# Altium project Second_project.PrjPcb
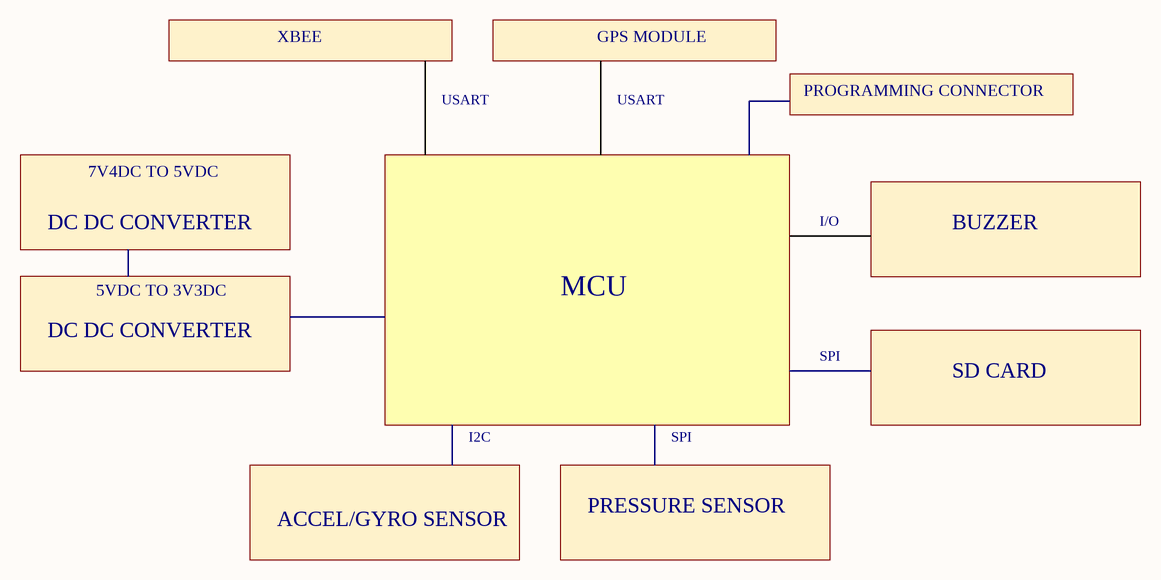
[diagram p0: BlockdiagramSTM32.SchDoc]
3 sheets, 43 parts. Net scope: flat (ports and power ports of the same name join across sheets).
Board file: PCB_STM32.PcbDoc
Sheets:
  BlockdiagramSTM32.SchDoc
  STM32.SchDoc
  MCUs_STM32.SchDoc

## Sheet BlockdiagramSTM32.SchDoc
size A3; SheetNumber: 1; SheetTotal: 3

### Notes on the sheet
- XBEE
- GPS MODULE
- USART
- PROGRAMMING CONNECTOR
- 7V4DC TO 5VDC
- I/O
- DC DC CONVERTER
- 5VDC TO 3V3DC
- BUZZER
- MCU
- SPI
- SD CARD
- I2C
- ACCEL/GYRO SENSOR
- PRESSURE SENSOR
- Document Name
- Prepared By
- Company Name
- Checked By
- A. Can KARACAN
- Release Date
- Department
- R&D- Hardware
- Size
- Change Date
- A3
- Approved By
- Sheet
- /

## Sheet STM32.SchDoc
size A3; SheetNumber: 2; SheetTotal: 3
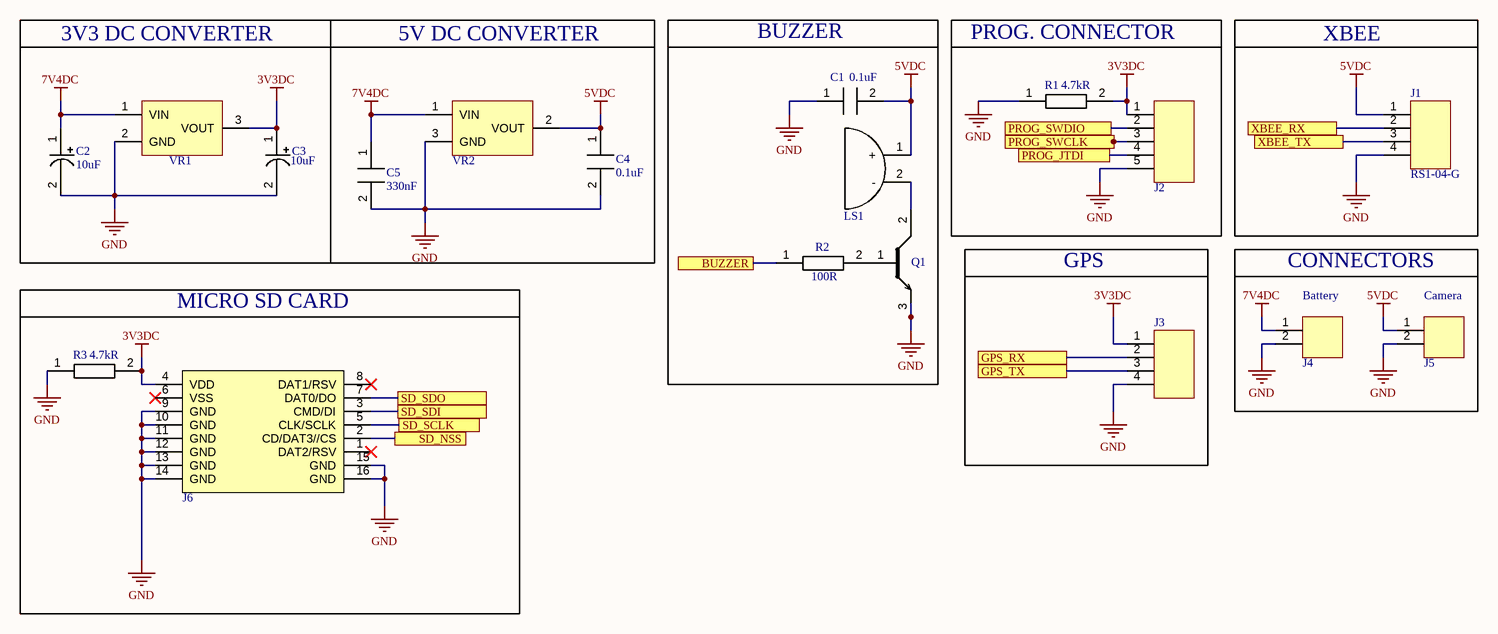
[diagram p1: STM32.SchDoc]

### Parts
C1  value 0.1uF  [CAP_1206]  (hidden comment: C1206C104K3RAC7800)
C2  value 10uF  [CAP_1206_TANT]  (hidden comment: T494A106M020AT)
C3  value 10uF  [CAP_1206_TANT]  (hidden comment: T494A106M020AT)
C4  value 0.1uF  [CAP_1206]  (hidden comment: C1206C104K3RAC7800)
C5  value 330nF  [CAP_1206]  (hidden comment: C1206C104K3RAC7800)
J1  RS1-04-G  [PINHEADER_1X4_TH]
J2  SMH-105-02-L-S  [PINHEADER1X5_RA]  (value not drawn)
J3  RS1-04-G  [PINHEADER_1X4_TH]  (value not drawn)
J4  0393570002  [2P_FEMALE_3.5MM_CONN]  (value not drawn)
J5  0393570002  [2P_FEMALE_3.5MM_CONN]  (value not drawn)
J6  2201778-1  [MICRO_SD]  (value not drawn)
LS1  CMI-9605-0580T  [CMI-9605]  (value not drawn)
Q1  MMBT3904-7-F  [SOT_23_3]  (value not drawn)
R1  value 4.7kR  [RE_1206]  (hidden comment: RC1206FR-074K7L)
R2  value 100R  [RE_0603]  (hidden comment: RC0603JR-07100RL)
R3  value 4.7kR  [RE_1206]  (hidden comment: RC1206FR-074K7L)
VR1  LD1117V33  [DPAK_TO-252-3]  (value not drawn)
VR2  L7805CDT-TR  [DPAK_TO-252-3]  (value not drawn)

### Blocks framed on the sheet
3V3 DC CONVERTER: C2 C3 VR1
BUZZER: C1 LS1 Q1 R2
PROG. CONNECTOR: J2 R1
XBEE: J1
CONNECTORS: J4 J5
GPS: J3

### Ports
BUZZER (see MCUs_STM32[4B]), GPS_RX (see MCUs_STM32[6B]), GPS_TX (see MCUs_STM32[6B]), PROG_JTDI (see MCUs_STM32[6B]), PROG_SWCLK (see MCUs_STM32[6B]), PROG_SWDIO (see MCUs_STM32[6B]), SD_NSS (see MCUs_STM32[4B]), SD_SCLK (see MCUs_STM32[4B]), SD_SDI (see MCUs_STM32[4C]), SD_SDO (see MCUs_STM32[4C]), XBEE_RX (see MCUs_STM32[6B]), XBEE_TX (see MCUs_STM32[6B])

### Nets
3V3DC: C3.1 J2.1 J3.1 J6.4(VDD) R1.2 R3.2 VR1.3(VOUT)
5VDC: C1.2 C4.1 J1.1 J5.1 LS1.1(+) VR2.2(VOUT)
7V4DC: C2.1 C5.1 J4.1 VR1.1(VIN) VR2.1(VIN)
GND: C1.1 C2.2 C3.2 C4.2 C5.2 J1.4 J2.5 J3.4 J4.2 J5.2 J6.9(GND) J6.10(GND) J6.11(GND) J6.12(GND) J6.13(GND) J6.14(GND) J6.15(GND) J6.16(GND) Q1.3 R1.1 R3.1 VR1.2(GND) VR2.3(GND)
NetJ1_2: J1.2 ; port XBEE_RX
NetJ1_3: J1.3 ; port XBEE_TX
NetJ2_2: J2.2 ; port PROG_SWDIO
NetJ2_3: J2.3 ; port PROG_SWCLK
NetJ2_4: J2.4 ; port PROG_JTDI
NetJ3_2: J3.2 ; port GPS_RX
NetJ3_3: J3.3 ; port GPS_TX
NetJ6_2: J6.2(CD/DAT3//CS) ; port SD_NSS
NetJ6_3: J6.3(CMD/DI) ; port SD_SDI
NetJ6_5: J6.5(CLK/SCLK) ; port SD_SCLK
NetJ6_7: J6.7(DAT0/DO) ; port SD_SDO
NetLS1_2: LS1.2(-) Q1.2
NetQ1_1: Q1.1 R2.2
NetR2_1: R2.1 ; port BUZZER

Not connected (* = marked no-connect by the designer): J6 1(DAT2/RSV)* 6(VSS)* 8(DAT1/RSV)*

### Notes on the sheet
- 5V DC CONVERTER
- MICRO SD CARD
- (near J4) Battery
- (near J5) Camera
- Document Name
- Prepared By
- Company Name
- Checked By
- A. Can KARACAN
- Release Date
- Department
- R&D- Hardware
- Size
- Change Date
- A3
- Approved By
- Sheet
- /

### Library data of the parts
C1 C4 = CAP CER 0.1uF 1206: Multilayer Ceramic Capacitor, 0.1 uF, 25 V, ± 10%, X7R, 1206 [3216 Metric]; Manufacturer: KEMET; Manufacturer Part Number: C1206C104K3RACTU; Material: 4241ConductorMaterial; Voltage Rating: 25V; Dissipation Factor: 3.5%; Designed By: Ahmet Can; Supplier: Digi-Key; Supplier Part Number: 399-C1206C104K3RAC7800CT-ND; RoHS: Yes; Category: Ceramic Capacitors; Stock: 306395; Pricing: 1=0,1, 10=0,072, 50=0,0408, 100=0,0338, 500=0,02372, 1000=0,01963 (USD); Mounting Technology: Surface Mount; Case/Package: 1206; Case Code (Metric): 3216; Case Code (Imperial): 1206; Dielectric Material: Ceramic; Min Operating Temperature: -55°C; Max Operating Temperature: 125°C; Tolerance: 10%; Dielectric: X7R; Packaging: Cut Tape; Package Quantity: 4000; Voltage Rating (DC): 25V; Termination: SMD/SMT; Series: C; Construction: Flat; Length: 3.2mm; Width: 0.063inch; Height: 0.78mm; Depth: 1.6mm; Thickness: 0.035inch; Reach SVHC Compliant: No; RoHS Compliant: Yes; ComponentLink1URL: https://datasheet.ciiva.com/5416/kem-c1002-x7r-smd-5416282.pdf?src-supplier=Mouser; ComponentLink1Description: https://datasheet.ciiva.com/5416/kem-c1002-x7r-smd-5416282.pdf?src-supplier=Mouser
C2 C3 = CAP TAN 10uF 2306: Cap Tant Solid 10uF 20V A CASE 20% (3.2 X 1.6 X 1.6mm) SMD 3216-18 3 Ohm 125 C T/R; Manufacturer: KEMET; Supplier: Digi-Key; Supplier Part Number: 399-5157-1-ND; Manufacturer Part Number: T494A106M020AT; RoHS: Yes; Category: Tantalum Capacitors; Stock: 64164; Pricing: 1=0,78, 10=0,596, 50=0,495, 100=0,4262, 500=0,32996, 1000=0,28414 (USD); ComponentLink1URL: https://datasheet.ciiva.com/22691/1778347-22691442.pdf?src-supplier=Element14; ComponentLink1Description: https://datasheet.ciiva.com/22691/1778347-22691442.pdf?src-supplier=Element14; ComponentLink2URL: https://datasheet.ciiva.com/258/kem-t2008-t494-258774.pdf?src-supplier=Digi-Key; ComponentLink2Description: https://datasheet.ciiva.com/258/kem-t2008-t494-258774.pdf?src-supplier=Digi-Key; ComponentLink3URL: https://datasheet.ciiva.com/258/kem-t2008-t494-258775.pdf?src-supplier=Digi-Key; ComponentLink3Description: https://datasheet.ciiva.com/258/kem-t2008-t494-258775.pdf?src-supplier=Digi-Key; ComponentLink4URL: https://datasheet.ciiva.com/258/kem-t2008-t494-258776.pdf?src-supplier=Digi-Key; ComponentLink4Description: https://datasheet.ciiva.com/258/kem-t2008-t494-258776.pdf?src-supplier=Digi-Key
C5 = CAP CER 330nF 1206: Cap Ceramic 0.33uF 16V X7R 10% SMD 1206 125°C Plastic T/R; Manufacturer: KEMET; Manufacturer Part Number: C1206C334K4RAC7800; Designed By: Ahmet Can; Supplier: Digi-Key; Supplier Part Number: 399-C1206C334K4RAC7800CT-ND; RoHS: Yes; Category: Ceramic Capacitors; Stock: 6810; Pricing: 1=0,21, 10=0,144, 50=0,096, 100=0,0816, 500=0,0576, 1000=0,0504 (USD); Mounting Technology: Surface Mount; Case/Package: 1206; Dielectric Material: Ceramic; Min Operating Temperature: -55°C; Max Operating Temperature: 125°C; Tolerance: 10%; Dielectric: X7R; Packaging: Tape and Reel; Voltage Rating (DC): 16V; Construction: Flat; Length: 3.2mm; Height: 0.78mm; Depth: 1.6mm; Radiation Hardening: No; RoHS Compliant: Yes; ComponentLink1URL: http://www.kemet.com/kemet/web/homepage/kechome.nsf/weben/C4DA2DA1D1C9D3C3CA2570A50016092D/$file/KEM_C1002_X7R_SMD.pdf; ComponentLink1Description: http://www.kemet.com/kemet/web/homepage/kechome.nsf/weben/C4DA2DA1D1C9D3C3CA2570A50016092D/$file/KEM_C1002_X7R_SMD.pdf
J1 J3 = J_RS1-04-G: 4 Position Receptacle Connector 0.100" (2.54mm) Through Hole Gold; Manufacturer: Adam Equipment; Supplier: Digi-Key; Supplier Part Number: 2057-RS1-04-G-ND; Manufacturer Part Number: RS1-04-G; RoHS: No; Category: Headers and Wire Housings; Stock: 4500; Pricing: 1=0,31, 10=0,267, 80=0,20788, 800=0,15695, 1600=0,14084, 5600=0,12726, 10400=0,11878 (USD); ComponentLink1URL: https://datasheet.ciiva.com/19462/2169758-19462353.pdf?src-supplier=Jameco; ComponentLink1Description: https://datasheet.ciiva.com/19462/2169758-19462353.pdf?src-supplier=Jameco
J2 = J_SMH-105-02-L-S: 5 Position Receptacle Connector 0.100" (2.54mm) Surface Mount, Right Angle Gold; Manufacturer: Samtec; Number of Contacts: 5; Designed By: Ahmet Can; Supplier: Digi-Key; Supplier Part Number: SAM11813-ND; Manufacturer Part Number: SMH-105-02-L-S; RoHS: Yes; Category: Connectors; Stock: 47; Pricing: 1=2,18, 10=1,899, 100=1,6968, 500=1,414, 1000=1,212, 5000=1,07464 (USD); Contact Plating: Gold; Contact Material: Bronze; Contact Finish - Mating: GOLD; Insulation Color: Black; Insulation Material: Polymer; Contact Shape: Square; Min Operating Temperature: -55°C; Max Operating Temperature: 125°C; Packaging: Rail/Tube; Number of Rows: 1; Termination: Solder; Gender: Receptacle; Orientation: Horizontal; Connector Type: Receptacle; Fastening Type: Pull; Series: SMH; Contact Type: Forked; Number of Positions: 5; Pitch: 2.54mm; Radiation Hardening: No; RoHS Compliant: Yes; Reach SVHC Compliant: No; Flammability Rating: UL94 V-0; ComponentLink1URL: http://www.farnell.com/datasheets/1927708.pdf?_ga=2.237598468.569325269.1503285096-1413671594.1503025027&src-supplier=Farnell; ComponentLink1Description: http://www.farnell.com/datasheets/1927708.pdf?_ga=2.237598468.569325269.1503285096-1413671594.1503025027&src-supplier=Farnell; ComponentLink2URL: http://www.samtec.com/documents/webfiles/pdf/SMH.PDF?src-supplier=Newark; ComponentLink2Description: http://www.samtec.com/documents/webfiles/pdf/SMH.PDF?src-supplier=Newark; ComponentLink3URL: http://www.samtec.com/documents/webfiles/pdf/SMH.PDF?src-supplier=Avnet; ComponentLink3Description: http://www.samtec.com/documents/webfiles/pdf/SMH.PDF?src-supplier=Avnet; ComponentLink4URL: http://suddendocs.samtec.com/catalog_english/smh.pdf?src-supplier=Digi-Key; ComponentLink4Description: http://suddendocs.samtec.com/catalog_english/smh.pdf?src-supplier=Digi-Key
J4 J5 = J_2P_FML_3.5MM: 3.50mm Pitch Beau Eurostyle Fixed Mount PCB Terminal Block, 2 Circuits; Manufacturer: Molex; Supplier: Digi-Key; Supplier Part Number: WM7877-ND; Manufacturer Part Number: 0393570002; RoHS: Yes; Stock: 107955; Pricing: 1=1,04, 10=0,729, 25=0,6804, 50=0,6174, 100=0,6147, 250=0,51908, 500=0,49176, 1000=0,43713, 5000=0,35517 (USD); ComponentLink1URL: https://datasheet.ciiva.com/6751/393590004-sd-6751377.pdf?src-supplier=Digi-Key; ComponentLink1Description: https://datasheet.ciiva.com/6751/393590004-sd-6751377.pdf?src-supplier=Digi-Key
J6 = J_2201778-1: Conn Memory Card RCP 8 POS 1.1mm Solder RA SMD 0.5A/Contact T/R; Manufacturer: TE Connectivity; Underplate Material: Nickel; Number of Positions: 8; Shielding: Unshielded; Contact Current Rating: 500mA; Circuit Application: Signal; Pitch: 0.04inch; Designed By: Ahmet Can; Supplier: Digi-Key; Supplier Part Number: A118117CT-ND; Manufacturer Part Number: 2201778-1; RoHS: Yes; Category: Memory Connectors; Stock: 6669; Pricing: 1=2,81, 10=2,503, 25=2,49, 50=2,4646, 100=2,2614, 250=2,24864, 500=2,04538 (USD); Mounting Technology: Surface Mount; Contact Material: Copper Alloy; Contact Plating: Gold; Housing Color: Black; Color: Black; Housing Material: Polymer; Shell Material: Copper Alloy; Min Operating Temperature: -30°C; Max Operating Temperature: 85°C; Packaging: Tape and Reel; Number of Rows: 1; Series: -; Termination: SMD/SMT; Flammability Rating: UL94 V-0; RoHS Compliant: Yes; Lead Free: Lead Free; ELV: Compliant; Reach SVHC Compliant: Unknown; ComponentLink1URL: https://datasheet.ciiva.com/23834/1737844-23834387.pdf?src-supplier=Newark; ComponentLink1Description: https://datasheet.ciiva.com/23834/1737844-23834387.pdf?src-supplier=Newark; ComponentLink2URL: https://datasheet.ciiva.com/22783/600547-22783409.pdf?src-supplier=Farnell; ComponentLink2Description: https://datasheet.ciiva.com/22783/600547-22783409.pdf?src-supplier=Farnell; ComponentLink3URL: https://datasheet.ciiva.com/22796/1651579-22796241.pdf?src-supplier=Farnell; ComponentLink3Description: https://datasheet.ciiva.com/22796/1651579-22796241.pdf?src-supplier=Farnell; ComponentLink4URL: https://datasheet.ciiva.com/29722/eng-cd-2201778-a-29722873.pdf?src-supplier=Digi-Key; ComponentLink4Description: https://datasheet.ciiva.com/29722/eng-cd-2201778-a-29722873.pdf?src-supplier=Digi-Key; ComponentLink5URL: https://datasheet.ciiva.com/22710/600547-22710877.pdf?src-supplier=Element14; ComponentLink5Description: https://datasheet.ciiva.com/22710/600547-22710877.pdf?src-supplier=Element14; ComponentLink6URL: https://datasheet.ciiva.com/22726/600547-22726299.pdf?src-supplier=Element14; ComponentLink6Description: https://datasheet.ciiva.com/22726/600547-22726299.pdf?src-supplier=Element14; ComponentLink7URL: https://datasheet.ciiva.com/29722/eng-cd-2201778-a-29722874.pdf?src-supplier=Digi-Key; ComponentLink7Description: https://datasheet.ciiva.com/29722/eng-cd-2201778-a-29722874.pdf?src-supplier=Digi-Key
LS1 = LS_CMI-9605-0580T: 9.6 mm, 5 Vdc, 80 dB, Through Hole, Driving Circuit, Magnetic Audio Indicator Buzzer; Manufacturer: CUI; Designed By: Ahmet Can; Min Supply Voltage: 3V; Max Supply Voltage: 7V; SPL: 80dB @ 5V, 10cm; Nominal Supply Voltage: 5V; Frequency: 2.7kHz; Supply Current: 30mA; Supplier: Digi-Key; Supplier Part Number: 102-CMI-9605-0580T-ND; Manufacturer Part Number: CMI-9605-0580T; RoHS: No; Max Operating Temperature: 70°C; Min Operating Temperature: -30°C; Mounting Technology: Through Hole; Packaging: Box; Case/Package: CMI-9605; Voltage Rating: 5V
Q1 = Q_MMBT3904-7-F: Transistor General Purpose BJT NPN 40 Volt 0.2A Automotive 3-Pin SOT-23-3; Manufacturer: Diodes Zetex; Max Power Dissipation: 300mW; Collector Emitter Voltage (VCEO): 40V; Max Collector Current: 200mA; Collector Base Voltage (VCBO): 60V; Power Dissipation: 350mW; Frequency: 300MHz; hFE Min: 100; Number of Elements: 1; Emitter Base Voltage (VEBO): 6V; Collector Emitter Saturation Voltage: 300mV; Designed By: Ahmet Can; Supplier: Digi-Key; Supplier Part Number: MMBT3904-FDICT-ND; Manufacturer Part Number: MMBT3904-7-F; RoHS: Yes; Category: BJTs; Stock: 5948624; Pricing: 1=0,12, 10=0,111, 100=0,0607, 500=0,03732, 1000=0,02545 (USD); Mounting Technology: Surface Mount; Case/Package: SOT-23; Pins: 3; Weight: 0.000282oz; Min Operating Temperature: -55°C; Max Operating Temperature: 150°C; Polarity: NPN; Packaging: Tape and Reel; Voltage Rating (DC): 40V; Package Quantity: 3000; Transition Frequency: 300MHz; Collector Emitter Breakdown Voltage: 40V; Max Breakdown Voltage: 40V; Continuous Collector Current: 200mA; Clock Frequency: 300MHz; Gain Bandwidth Product: 300MHz; Series: Automotive, AEC-Q101; Collector-emitter Voltage-Max: 300mV; Length: 3.05mm; Width: 1.4mm; Height: 1mm; Radiation Hardening: No; Reach SVHC Compliant: No; Lead Free: Lead Free; RoHS Compliant: Yes; ComponentLink1URL: https://datasheet.ciiva.com/11201/ds30036-11201778.pdf?src-supplier=Avnet; ComponentLink1Description: https://datasheet.ciiva.com/11201/ds30036-11201778.pdf?src-supplier=Avnet; ComponentLink2URL: https://datasheet.ciiva.com/15138/getdatasheetpartid-53265-15138780.pdf?src-supplier=Verical; ComponentLink2Description: https://datasheet.ciiva.com/15138/getdatasheetpartid-53265-15138780.pdf?src-supplier=Verical; ComponentLink3URL: https://datasheet.ciiva.com/22711/1915516-22711750.pdf?src-supplier=Element14; ComponentLink3Description: https://datasheet.ciiva.com/22711/1915516-22711750.pdf?src-supplier=Element14; ComponentLink4URL: https://datasheet.ciiva.com/11198/ds30036-11198999.pdf?src-supplier=Avnet; ComponentLink4Description: https://datasheet.ciiva.com/11198/ds30036-11198999.pdf?src-supplier=Avnet; ComponentLink5URL: https://datasheet.ciiva.com/6361/ds30036-6361256.pdf?src-supplier=Digi-Key; ComponentLink5Description: https://datasheet.ciiva.com/6361/ds30036-6361256.pdf?src-supplier=Digi-Key; ComponentLink6URL: https://datasheet.ciiva.com/6361/ds30036-6361254.pdf?src-supplier=Digi-Key; ComponentLink6Description: https://datasheet.ciiva.com/6361/ds30036-6361254.pdf?src-supplier=Digi-Key
R1 R3 = RES 4K7 1206: SMD Chip Resistor, 4.7 kOhm, ± 1%, 250 mW, 1206 [3216 Metric], Thick Film, General Purpose; Manufacturer: Yageo; Voltage Rating (DC): 200V; Temperature Coefficient: 100ppm/°C; Power Rating: 250mW; Designed By: Ahmet Can; Supplier: Digi-Key; Supplier Part Number: 311-4.70KFRCT-ND; Manufacturer Part Number: RC1206FR-074K7L; RoHS: Yes; Category: Chip SMD Resistors; Stock: 2180352; Pricing: 1=0,1, 10=0,036, 50=0,0232, 100=0,0195, 500=0,01364, 1000=0,01187 (USD); Case/Package: 1206; Pins: 2; Case Code (Imperial): 1206; Case Code (Metric): 3216; Min Operating Temperature: -55°C; Max Operating Temperature: 155°C; Tolerance: 1%; Packaging: Tape and Reel; Resistor Type: Thick Film; Voltage Rating: 200V; Series: RC02H; Resistance Tolerance: 1%; Width: 1.6mm; Lead Free: Lead Free; Reach SVHC Compliant: Unknown; RoHS Compliant: Yes
R2 = RES 100 0603: Res Thick Film 0603 100 Ohm 5% 1/10W ±100ppm/°C Molded SMD SMD Paper T/R; Manufacturer: Yageo; Voltage Rating (DC): 50V; Power Rating: 100mW; Designed By: Ahmet Can; Supplier: Digi-Key; Supplier Part Number: 311-100GRCT-ND; Manufacturer Part Number: RC0603JR-07100RL; RoHS: Yes; Category: Chip SMD Resistors; Stock: 909469; Pricing: 1=0,1, 10=0,014, 50=0,0088, 100=0,0073, 500=0,00486, 1000=0,00415 (USD); Case/Package: 0603; Pins: 2; Contact Plating: Tin,Matte; Case Code (Imperial): 0603; Case Code (Metric): 1608; Min Operating Temperature: -55°C; Max Operating Temperature: 155°C; Tolerance: 5%; Temperature Coefficient: 100ppm/°C; Resistor Type: Thick Film; Packaging: Tape and Reel; Voltage Rating: 50V; Termination: SMD/SMT; Features: Moisture Resistant; Series: RC; Max Power Dissipation: 100mW; Number of Terminations: 2; Construction: Rectangular; Resistance Tolerance: 5%; Length: 1.6mm; Width: 0.8mm; Depth: 0.8mm; Lead Free: Lead Free; Reach SVHC Compliant: Unknown; Military Standard: Not; RoHS Compliant: Yes; ComponentLink1URL: https://datasheet.ciiva.com/7746/443971-7746425.pdf?src-supplier=Element14; ComponentLink1Description: https://datasheet.ciiva.com/7746/443971-7746425.pdf?src-supplier=Element14; ComponentLink2URL: https://datasheet.ciiva.com/7746/443971-7746426.pdf?src-supplier=Element14; ComponentLink2Description: https://datasheet.ciiva.com/7746/443971-7746426.pdf?src-supplier=Element14; ComponentLink3URL: https://datasheet.ciiva.com/8883/pyu-rc0603-51-rohs-l-4-8883047.pdf?src-supplier=Avnet; ComponentLink3Description: https://datasheet.ciiva.com/8883/pyu-rc0603-51-rohs-l-4-8883047.pdf?src-supplier=Avnet; ComponentLink4URL: https://datasheet.ciiva.com/15189/getdatasheetpartid-325207-15189846.pdf?src-supplier=Verical; ComponentLink4Description: https://datasheet.ciiva.com/15189/getdatasheetpartid-325207-15189846.pdf?src-supplier=Verical
VR1 = VR_LD1086DT33TR: LDO Regulator Pos 3.3V 1.3A 3-Pin(3+Tab) TO-220AB Tube; Manufacturer: STMicroelectronics; Max Supply Voltage: 15V; Number of Outputs: 1; Max Power Dissipation: 12W; Polarity: Positive; Quiescent Current: 10mA; Accuracy: 1%; Output Type: Fixed; Dropout Voltage: 1.1V; Input Bias Current: 5mA; Power Supply Rejection Ratio (PSRR): 75dB; Designed By: Ahmet Can; Supplier: Digi-Key; Supplier Part Number: 497-1491-5-ND; Manufacturer Part Number: LD1117V33; RoHS: Yes; Category: Voltage Regulators - Linear; Stock: 1467; Pricing: 1=0,83, 25=0,6952, 100=0,5566, 500=0,44002, 2500=0,3185, 10000=0,29008 (USD); Mounting Technology: Through Hole; Case/Package: TO; Pins: 3; Min Operating Temperature: 0°C; Max Operating Temperature: 125°C; Max Output current: 1.3A; Output Voltage: 3.3V; Output Current: 1.3A; Packaging: Rail/Tube; Number of Regulators: 1; Series: -; Package Quantity: 1000; Nominal Output Voltage: 3.3V; Power Dissipation: 12W; Min Output Voltage: 3.3V; Output Voltage Accuracy: 1%; Output Configuration: Positive; Supply Current: 5mA; Length: 10.4mm; Width: 4.6mm; Height: 9.15mm; Radiation Hardening: No; RoHS Compliant: Yes; Reach SVHC Compliant: No; Lead Free: Lead Free; ComponentLink1URL: https://datasheet.ciiva.com/27055/1991854-27055801.pdf?src-supplier=Jameco; ComponentLink1Description: https://datasheet.ciiva.com/27055/1991854-27055801.pdf?src-supplier=Jameco; ComponentLink2URL: https://datasheet.ciiva.com/15110/getdatasheetpartid-31296-15110899.pdf?src-supplier=Verical; ComponentLink2Description: https://datasheet.ciiva.com/15110/getdatasheetpartid-31296-15110899.pdf?src-supplier=Verical; ComponentLink3URL: https://datasheet.ciiva.com/2044/cd00000544-2044225.pdf?src-supplier=Digi-Key; ComponentLink3Description: https://datasheet.ciiva.com/2044/cd00000544-2044225.pdf?src-supplier=Digi-Key; ComponentLink4URL: https://datasheet.ciiva.com/1511/1776449-1511579.pdf?src-supplier=Element14; ComponentLink4Description: https://datasheet.ciiva.com/1511/1776449-1511579.pdf?src-supplier=Element14; ComponentLink5URL: https://datasheet.ciiva.com/16457/cd00000544-16457726.pdf?src-supplier=Future+Electronics; ComponentLink5Description: https://datasheet.ciiva.com/16457/cd00000544-16457726.pdf?src-supplier=Future+Electronics
VR2 = VR_L7805CDT-TR: IC REG LDO 5V 1.5A DPAK; Manufacturer: STMicroelectronics; Designed By: Ahmet Can; Supplier: Digi-Key; Supplier Part Number: 497-7255-1-ND; Manufacturer Part Number: L7805CDT-TR; RoHS: Yes; Category: Voltage Regulators - Linear; Stock: 44558; Pricing: 1=1,12, 10=1, 25=0,9488, 100=0,7795, 250=0,72868, 500=0,64396, 1000=0,50839 (USD); ComponentLink1URL: https://datasheet.ciiva.com/2042/cd00000444-2042783.pdf?src-supplier=Digi-Key; ComponentLink1Description: https://datasheet.ciiva.com/2042/cd00000444-2042783.pdf?src-supplier=Digi-Key; ComponentLink2URL: https://datasheet.ciiva.com/2042/cd00000444-2042784.pdf?src-supplier=Digi-Key; ComponentLink2Description: https://datasheet.ciiva.com/2042/cd00000444-2042784.pdf?src-supplier=Digi-Key; ComponentLink3URL: https://datasheet.ciiva.com/2042/cd00000444-2042785.pdf?src-supplier=Digi-Key; ComponentLink3Description: https://datasheet.ciiva.com/2042/cd00000444-2042785.pdf?src-supplier=Digi-Key; ComponentLink4URL: https://datasheet.ciiva.com/16357/cd00000444-16357893.pdf?src-supplier=Future+Electronics; ComponentLink4Description: https://datasheet.ciiva.com/16357/cd00000444-16357893.pdf?src-supplier=Future+Electronics; ComponentLink5URL: https://datasheet.ciiva.com/4882/cd00000444-4882231.pdf?src-supplier=Mouser; ComponentLink5Description: https://datasheet.ciiva.com/4882/cd00000444-4882231.pdf?src-supplier=Mouser

## Sheet MCUs_STM32.SchDoc
size A3; SheetNumber: 3; SheetTotal: 3
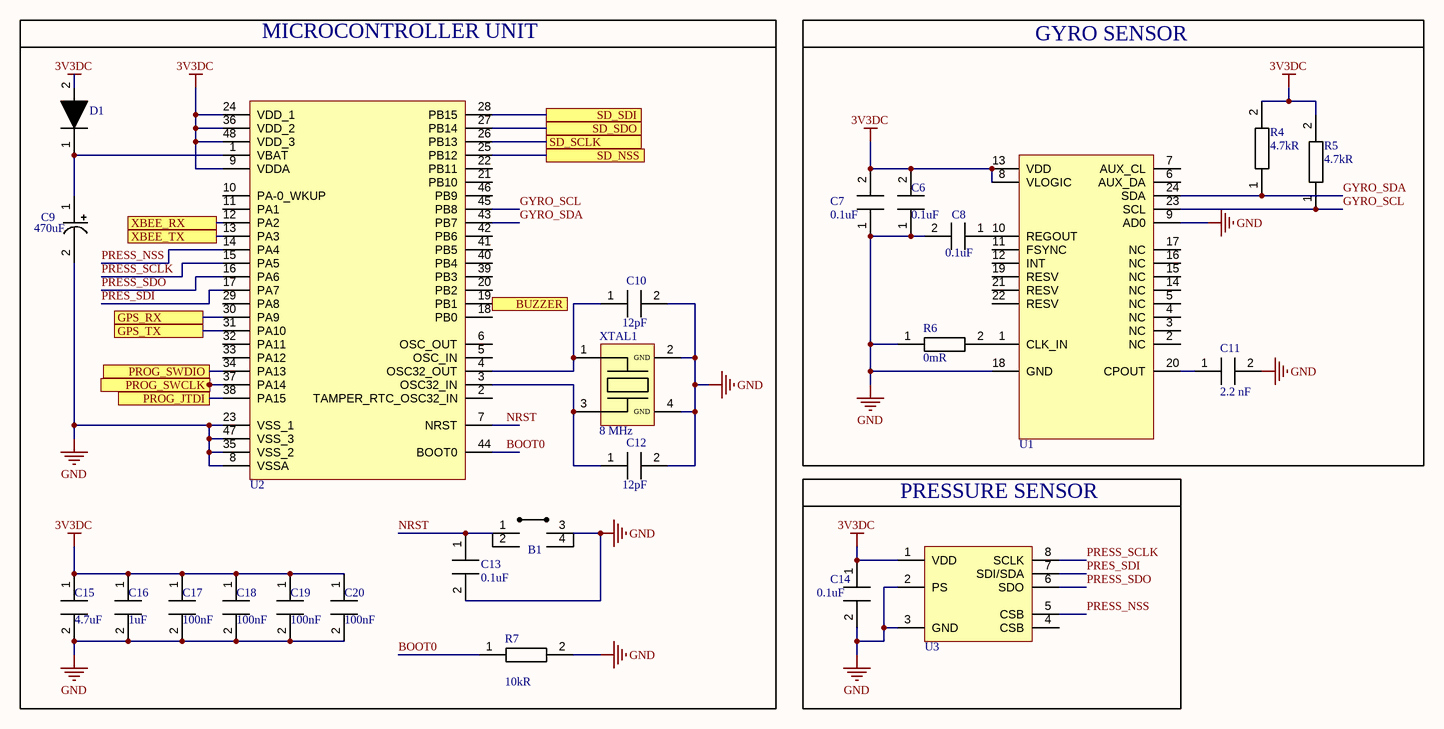
[diagram p2: MCUs_STM32.SchDoc]

### Parts
B1  B_D6R90 F1 LFS  [PBUTTON_OFFMOM]  (value not drawn)
C6  value 0.1uF  [CAP_1206]  (hidden comment: C1206C104K3RAC7800)
C7  value 0.1uF  [CAP_1206]  (hidden comment: C1206C104K3RAC7800)
C8  value 0.1uF  [CAP_1206]  (hidden comment: C1206C104K3RAC7800)
C9  value 470uF  [CAP_RADIAL_D10_P5]  (hidden comment: ESH477M050AH4AA)
C10  value 12pF  [CAP_1206]  (hidden comment: C1206C120J5GAC7800)
C11  value 2.2 nF  [CAP_1206]  (hidden comment: CC1206KRX7R9BB222)
C12  value 12pF  [CAP_1206]  (hidden comment: C1206C120J5GAC7800)
C13  value 0.1uF  [CAP_1206]  (hidden comment: C1206C104K3RAC7800)
C14  value 0.1uF  [CAP_1206]  (hidden comment: C1206C104K3RAC7800)
C15  value 4.7uF  [CAP_0805]  (hidden comment: CL21A475KAQNNNE)
C16  value 1uF  [CAP_0805]  (hidden comment: CL21B105KBFNNNE)
C17  Capacitance: 100nF  [CAP_0805]  (hidden comment: CL21B104KBCNNNC)
C18  Capacitance: 100nF  [CAP_0805]  (hidden comment: CL21B104KBCNNNC)
C19  Capacitance: 100nF  [CAP_0805]  (hidden comment: CL21B104KBCNNNC)
C20  Capacitance: 100nF  [CAP_0805]  (hidden comment: CL21B104KBCNNNC)
D1  1N4148WS  [SOD_323_F]  (value not drawn)
R4  value 4.7kR  [RE_1206]  (hidden comment: RC1206FR-074K7L)
R5  value 4.7kR  [RE_1206]  (hidden comment: RC1206FR-074K7L)
R6  value 0mR  [RE_0603]  (hidden comment: RC0603JR-070RL)
R7  value 10kR  [RE_1206]  (hidden comment: RC1206FR-0710KL)
U1  MPU6050  [QFN_24]  (value not drawn)
U2  STM32F103C8T6  [LQGP48-STM]  (value not drawn)
U3  MS560702BA03-50  [8-SMD_MS560702BA03]  (value not drawn)
XTAL1  value 8 MHz  [4-SMD, No Lead]  (hidden comment: ECS-80-10-30B-CKM-TR)

### Blocks framed on the sheet
MICROCONTROLLER UNIT: B1 C9 C10 C12 C13 C15-C20 D1 R7 U2 XTAL1
GYRO SENSOR: C6-C8 C11 R4-R6 U1
PRESSURE SENSOR: C14 U3

### Ports
BUZZER (see STM32[4B]), GPS_RX (see STM32[3A]), GPS_TX (see STM32[3A]), PROG_JTDI (see STM32[2B]), PROG_SWCLK (see STM32[2B]), PROG_SWDIO (see STM32[2B]), SD_NSS (see STM32[5A]), SD_SCLK (see STM32[5A]), SD_SDI (see STM32[5A]), SD_SDO (see STM32[5A]), XBEE_RX (see STM32[2B]), XBEE_TX (see STM32[2B])

### Nets
3V3DC: C6.2 C7.2 C14.1 C15.1 C16.1 C17.1 C18.1 C19.1 C20.1 D1.2 R4.2 R5.2 U1.8(VLOGIC) U1.13(VDD) U2.9(VDDA) U2.24(VDD_1) U2.36(VDD_2) U2.48(VDD_3) U3.1(VDD)
GND: B1.3 C6.1 C7.1 C8.2 C9.2 C10.2 C11.2 C12.2 C13.2 C14.2 C15.2 C16.2 C17.2 C18.2 C19.2 C20.2 R6.1 R7.2 U1.9(AD0) U1.18(GND) U2.8(VSSA) U2.23(VSS_1) U2.35(VSS_2) U2.47(VSS_3) U3.2(PS) U3.3(GND) XTAL1.2(GND) XTAL1.4(GND)
BOOT0: R7.1 U2.44(BOOT0)
GYRO_SCL: R5.1 U1.23(SCL) U2.45(PB8)
GYRO_SDA: R4.1 U1.24(SDA) U2.43(PB7)
NRST: B1.1 C13.1 U2.7(NRST)
PRES_SDI: U2.17(PA7) U3.7(SDI/SDA)
PRESS_NSS: U2.14(PA4) U3.5(CSB)
PRESS_SCLK: U2.15(PA5) U3.8(SCLK)
PRESS_SDO: U2.16(PA6) U3.6(SDO)
NetC8_1: C8.1 U1.10(REGOUT)
NetC9_1: C9.1 D1.1 U2.1(VBAT)
NetC10_1: C10.1 U2.4(OSC32_OUT) XTAL1.1
NetC11_1: C11.1 U1.20(CPOUT)
NetC12_1: C12.1 U2.3(OSC32_IN) XTAL1.3
NetJ1_2: U2.12(PA2) ; port XBEE_RX
NetJ1_3: U2.13(PA3) ; port XBEE_TX
NetJ2_2: U2.34(PA13) ; port PROG_SWDIO
NetJ2_3: U2.37(PA14) ; port PROG_SWCLK
NetJ2_4: U2.38(PA15) ; port PROG_JTDI
NetJ3_2: U2.30(PA9) ; port GPS_RX
NetJ3_3: U2.31(PA10) ; port GPS_TX
NetJ6_2: U2.25(PB12) ; port SD_NSS
NetJ6_3: U2.28(PB15) ; port SD_SDI
NetJ6_5: U2.26(PB13) ; port SD_SCLK
NetJ6_7: U2.27(PB14) ; port SD_SDO
NetR2_1: U2.19(PB1) ; port BUZZER
NetR6_2: R6.2 U1.1(CLK_IN)

Not connected (* = marked no-connect by the designer): B1 2 4; U1 2(NC) 3(NC) 4(NC) 5(NC) 6(AUX_DA) 7(AUX_CL) 11(FSYNC) 12(INT) 14(NC) 15(NC) 16(NC) 17(NC) 19(RESV) 21(RESV) 22(RESV); U2 2(TAMPER_RTC_OSC32_IN) 5(OSC_IN) 6(OSC_OUT) 10(PA-0_WKUP) 11(PA1) 18(PB0) 20(PB2) 21(PB10) 22(PB11) 29(PA8) 32(PA11) 33(PA12) 39(PB3) 40(PB4) 41(PB5) 42(PB6) 46(PB9); U3 4(CSB)

### Notes on the sheet
- Document Name
- Prepared By
- Company Name
- Checked By
- A. Can KARACAN
- Release Date
- Department
- R&D- Hardware
- Size
- Change Date
- A3
- Approved By
- Sheet
- /

### Library data of the parts
C6-C8 C13 C14 = CAP CER 0.1uF 1206: as C1 on sheet STM32; Supplier: Digi-Key; Supplier Part Number: 399-C1206C104K3RAC7800CT-ND; RoHS: Yes; Category: Ceramic Capacitors; Stock: 306395; Pricing: 1=0,1, 10=0,072, 50=0,0408, 100=0,0338, 500=0,02372, 1000=0,01963 (USD); Mounting Technology: Surface Mount; Case/Package: 1206; Case Code (Metric): 3216; Case Code (Imperial): 1206; Dielectric Material: Ceramic; Min Operating Temperature: -55°C; Max Operating Temperature: 125°C; Tolerance: 10%; Dielectric: X7R; Packaging: Cut Tape; Package Quantity: 4000; Voltage Rating (DC): 25V; Termination: SMD/SMT; Series: C; Construction: Flat; Length: 3.2mm; Width: 0.063inch; Height: 0.78mm; Depth: 1.6mm; Thickness: 0.035inch; Reach SVHC Compliant: No; RoHS Compliant: Yes; ComponentLink1URL: https://datasheet.ciiva.com/5416/kem-c1002-x7r-smd-5416282.pdf?src-supplier=Mouser; ComponentLink1Description: https://datasheet.ciiva.com/5416/kem-c1002-x7r-smd-5416282.pdf?src-supplier=Mouser
C9 = CAP ALU ELEC 470uF: Cap, 470UF, 50V, Alu Elec, Radial, Through Hole; Manufacturer: KEMET; Designed By: Ahmet Can; Lifetime @ Temp.: 2000 Hrs @ 105°C; Ripple Current @ Low Frequency: 630 mA @ 120 Hz; Ripple Current @ High Frequency: 945 mA @ 10 kHz; Polarization: Polar; Tolerance: ±20%; Supplier: Digi-Key; Supplier Part Number: 399-15683-ND; Manufacturer Part Number: ESH477M050AH4AA; RoHS: Yes; Stock: 6383; Pricing: 1=0,64, 10=0,455, 50=0,344, 100=0,2997, 500=0,222, 1000=0,1887, 2500=0,1776, 5000=0,1665 (USD); ComponentLink1URL: https://api.kemet.com/component-edge/download/datasheet/ESH477M050AH4AA.pdf?src-supplier=Digi-Key; ComponentLink1Description: https://api.kemet.com/component-edge/download/datasheet/ESH477M050AH4AA.pdf?src-supplier=Digi-Key; ComponentLink2URL: https://datasheet.octopart.com/ESH477M050AH4AA-KEMET-datasheet-130075338.pdf?src-supplier=Newark; ComponentLink2Description: https://datasheet.octopart.com/ESH477M050AH4AA-KEMET-datasheet-130075338.pdf?src-supplier=Newark; Category: Aluminum Electrolytic Capacitors; Case/Package: TH, Radial, Can; Mounting Type: Through Hole; Voltage Rating: 50V; Min Operating Temperature: -40°C; Max Operating Temperature: 105°C
C10 C12 = CAP CER 12pF 1206: Multilayer Ceramic Capacitor, 12 pF, 50 V, ± 5%, C0G (NP0), 1206 [3216 Metric]; Manufacturer: KEMET; Manufacturer Part Number: C1206C120J5GACTU; Material: 4241ConductorMaterial; Voltage Rating: 50V; Dissipation Factor: 0.1%; Temperature Coefficient: 30ppm/°C; Designed By: Ahmet Can; Supplier: Digi-Key; Supplier Part Number: 399-C1206C120J5GAC7800CT-ND; RoHS: Yes; Category: Ceramic Capacitors; Stock: 15852; Pricing: 1=0,2, 10=0,14, 50=0,0838, 100=0,0708, 500=0,04842, 1000=0,04284 (USD); Mounting Technology: Surface Mount,PCB; Case/Package: 1206; Case Code (Metric): 3216; Case Code (Imperial): 1206; Weight: 0.000571oz; Dielectric Material: Ceramic; Min Operating Temperature: -55°C; Max Operating Temperature: 125°C; Tolerance: 5%; Dielectric: C0G; Packaging: Tape and Reel; Voltage Rating (DC): 50V; Termination: SMD/SMT; Voltage: 50V; Series: SMD Comm C0G; Construction: Flat; Length: 3.2mm; Width: 1.6mm; Height: 0.78mm; Depth: 1.6mm; Reach SVHC Compliant: No; Lead Free: Lead Free; RoHS Compliant: Yes; ComponentLink1URL: https://datasheet.ciiva.com/7730/1732697-7730097.pdf?src-supplier=Element14; ComponentLink1Description: https://datasheet.ciiva.com/7730/1732697-7730097.pdf?src-supplier=Element14; ComponentLink2URL: https://datasheet.ciiva.com/145/docfinderpartnumber-c1206c120j5gactu-145627.pdf?src-supplier=Digi-Key; ComponentLink2Description: https://datasheet.ciiva.com/145/docfinderpartnumber-c1206c120j5gactu-145627.pdf?src-supplier=Digi-Key; ComponentLink3URL: https://datasheet.ciiva.com/14595/70095383-14595525.pdf?src-supplier=Allied+Electronics; ComponentLink3Description: https://datasheet.ciiva.com/14595/70095383-14595525.pdf?src-supplier=Allied+Electronics; ComponentLink4URL: https://datasheet.ciiva.com/14604/70095383-14604488.pdf?src-supplier=Allied+Electronics; ComponentLink4Description: https://datasheet.ciiva.com/14604/70095383-14604488.pdf?src-supplier=Allied+Electronics
C11 = CAP CER 2.2 nF 1206: CAP CER 2200PF 50V X7R 1206; Manufacturer: Yageo; Supplier: Digi-Key; Supplier Part Number: 311-1171-1-ND; Manufacturer Part Number: CC1206KRX7R9BB222; RoHS: Yes; Category: Ceramic Capacitors; Stock: 22858; Pricing: 1=0,21, 10=0,145, 50=0,087, 100=0,0735, 500=0,05026, 1000=0,04446 (USD); ComponentLink1URL: https://datasheet.ciiva.com/29148/445097-da-01-en-kerko-chip-1206-x7r-2200pf-10proz-50vg-29148910.pdf?src-supplier=Conrad; ComponentLink1Description: https://datasheet.ciiva.com/29148/445097-da-01-en-kerko-chip-1206-x7r-2200pf-10proz-50vg-29148910.pdf?src-supplier=Conrad; ComponentLink2URL: https://datasheet.ciiva.com/26829/getdatasheetpartid-137961-26829676.pdf?src-supplier=Verical; ComponentLink2Description: https://datasheet.ciiva.com/26829/getdatasheetpartid-137961-26829676.pdf?src-supplier=Verical; ComponentLink3URL: https://datasheet.ciiva.com/145/mlccorderingcode-145128.pdf?src-supplier=Digi-Key; ComponentLink3Description: https://datasheet.ciiva.com/145/mlccorderingcode-145128.pdf?src-supplier=Digi-Key; ComponentLink4URL: https://datasheet.ciiva.com/145/mlccorderingcode-145129.pdf?src-supplier=Digi-Key; ComponentLink4Description: https://datasheet.ciiva.com/145/mlccorderingcode-145129.pdf?src-supplier=Digi-Key; ComponentLink5URL: https://datasheet.ciiva.com/145/mlccorderingcode-145130.pdf?src-supplier=Digi-Key; ComponentLink5Description: https://datasheet.ciiva.com/145/mlccorderingcode-145130.pdf?src-supplier=Digi-Key; ComponentLink6URL: https://datasheet.ciiva.com/11466/upy-gphc-x7r-6-3v-to-50v-8-11466764.pdf?src-supplier=Avnet; ComponentLink6Description: https://datasheet.ciiva.com/11466/upy-gphc-x7r-6-3v-to-50v-8-11466764.pdf?src-supplier=Avnet
C15 = CAP CER 4.7uF 0805: Multilayer Ceramic Capacitor, 4.7 uF, 25 V, ± 10%, X5R, 0805 [2012 Metric]; Manufacturer: Samsung; Material: 4241ConductorMaterial; Voltage Rating: 25V; Designed By: Ahmet Can; Supplier: Digi-Key; Supplier Part Number: 1276-1244-1-ND; Manufacturer Part Number: CL21A475KAQNNNE; RoHS: Yes; Category: Ceramic Capacitors; Stock: 3906800; Pricing: 1=0,1, 10=0,073, 50=0,0414, 100=0,0344, 500=0,02408, 1000=0,01994 (USD); Mounting Technology: Surface Mount; Case/Package: 0805; Case Code (Metric): 2012; Case Code (Imperial): 0805; Min Operating Temperature: -55°C; Max Operating Temperature: 85°C; Packaging: Tape and Reel; Tolerance: 10%; Dielectric: X5R; Voltage Rating (DC): 25V; Series: CL; Construction: Flat; Length: 2mm; Height: 1.25mm; Depth: 1.25mm; Radiation Hardening: No; Lead Free: Lead Free; RoHS Compliant: Yes; ComponentLink1URL: https://datasheet.ciiva.com/25798/cl21a475kaqnnne-25798882.pdf?src-supplier=Digi-Key; ComponentLink1Description: https://datasheet.ciiva.com/25798/cl21a475kaqnnne-25798882.pdf?src-supplier=Digi-Key
C16 = CAP CER 1uF 0805: CAP CER %10 1uF 0805; Manufacturer: Samsung; Material: 4241ConductorMaterial; Tolerance: 10%; Voltage Rating: 50V; Dielectric: X7R; Supplier: Digi-Key; Supplier Part Number: 1276-1029-1-ND; Manufacturer Part Number: CL21B105KBFNNNE; RoHS: Yes; Category: Ceramic Capacitors; Stock: 212507; Pricing: 1=0,11, 10=0,079, 50=0,045, 100=0,0373, 500=0,02616, 1000=0,02165 (USD); Mounting Technology: Surface Mount; Case/Package: 0805; Case Code (Metric): 2012; Case Code (Imperial): 0805; Min Operating Temperature: -55°C; Max Operating Temperature: 125°C; Packaging: Tape and Reel; Package Quantity: 1; Voltage: 50V; Series: CL; Construction: Flat; Voltage Rating (DC): 50V; Length: 2mm; Width: 0.049inch; Height: 1.25mm; Thickness: 0.053inch; Depth: 1.25mm; Radiation Hardening: No; RoHS Compliant: Yes; ComponentLink1URL: https://datasheet.ciiva.com/25800/cl21b105kbfnnne-25800291.pdf?src-supplier=Digi-Key; ComponentLink1Description: https://datasheet.ciiva.com/25800/cl21b105kbfnnne-25800291.pdf?src-supplier=Digi-Key; ComponentLink2URL: https://datasheet.ciiva.com/16449/cl21b105kbfnnne-16449003.pdf?src-supplier=Future+Electronics; ComponentLink2Description: https://datasheet.ciiva.com/16449/cl21b105kbfnnne-16449003.pdf?src-supplier=Future+Electronics
C17-C20 = CAP CER 100nF 0805: Multilayer Ceramic Capacitor, 0.1 uF, 50 V, ± 10%, X7R, 0805 [2012 Metric]; Manufacturer: Samsung; Voltage Rating: 50V; Supplier: Digi-Key; Supplier Part Number: 1276-1003-1-ND; Manufacturer Part Number: CL21B104KBCNNNC; RoHS: Yes; Category: Ceramic Capacitors; Stock: 1461740; Pricing: 1=0,1, 10=0,044, 50=0,024, 100=0,0196, 500=0,01404, 1000=0,01103 (USD); Mounting Technology: Surface Mount; Case/Package: 0805; Case Code (Metric): 2012; Case Code (Imperial): 0805; Material: Ceramic; Min Operating Temperature: -55°C; Max Operating Temperature: 125°C; Tolerance: 10%; Dielectric: X7R; Packaging: Tape and Reel; Voltage: 50V; Voltage Rating (DC): 50V; Series: CL; Construction: Flat; Length: 2mm; Width: 0.049inch; Height: 0.85mm; Depth: 1.25mm; Thickness: 0.037inch; Radiation Hardening: No; Lead Free: Lead Free; RoHS Compliant: Yes; ComponentLink1URL: https://datasheet.ciiva.com/25710/cl21b104kbcnnnc-25710182.pdf?src-supplier=Digi-Key; ComponentLink1Description: https://datasheet.ciiva.com/25710/cl21b104kbcnnnc-25710182.pdf?src-supplier=Digi-Key; ComponentLink2URL: https://datasheet.ciiva.com/29199/454152-da-01-en-vs-kondensator-0805-29199814.pdf?src-supplier=Conrad; ComponentLink2Description: https://datasheet.ciiva.com/29199/454152-da-01-en-vs-kondensator-0805-29199814.pdf?src-supplier=Conrad
D1 = DIO_1N4148WS: Diode Ultra Fast Recovery Rectifier 75V 0.15A 2-Pin SOD-323F T/R; Manufacturer: ON Semiconductor / Fairchild; Forward Current: 150mA; Max Forward Surge Current (Ifsm): 2A; Max Reverse Current: 5uA; Reverse Recovery Time: 4ns; Element Configuration: Single; Designed By: Ahmet Can; Supplier: Digi-Key; Supplier Part Number: 1N4148WSFSCT-ND; Manufacturer Part Number: 1N4148WS; RoHS: Yes; Category: Rectifier Diodes; Stock: 1299120; Pricing: 1=0,17, 10=0,159, 100=0,0867, 500=0,05332, 1000=0,03636 (USD); Mounting Technology: Surface Mount; Pins: 2; Weight: 0.0276g; Min Operating Temperature: -55°C; Max Operating Temperature: 150°C; Packaging: Tape and Reel; Max Repetitive Reverse Voltage (Vrrm): 75V; Average Rectified Current: 150mA; Max Reverse Voltage (DC): 75V; Series: -; Package Quantity: 1; Recovery Time: 4ns; Reverse Voltage: 75V; Length: 1.8mm; Width: 1.35mm; Height: 1mm; Radiation Hardening: No; RoHS Compliant: Yes; Reach SVHC Compliant: No; Lead Free: Lead Free; ComponentLink1URL: https://datasheet.ciiva.com/15208/getdatasheetpartid-127819-15208358.pdf?src-supplier=Verical; ComponentLink1Description: https://datasheet.ciiva.com/15208/getdatasheetpartid-127819-15208358.pdf?src-supplier=Verical; ComponentLink2URL: https://datasheet.ciiva.com/8300/1n914bws-8300360.pdf?src-supplier=Avnet; ComponentLink2Description: https://datasheet.ciiva.com/8300/1n914bws-8300360.pdf?src-supplier=Avnet; ComponentLink3URL: https://datasheet.ciiva.com/910/1n4148ws-910381.pdf?src-supplier=Digi-Key; ComponentLink3Description: https://datasheet.ciiva.com/910/1n4148ws-910381.pdf?src-supplier=Digi-Key; ComponentLink4URL: https://datasheet.ciiva.com/910/1n4148ws-910382.pdf?src-supplier=Digi-Key; ComponentLink4Description: https://datasheet.ciiva.com/910/1n4148ws-910382.pdf?src-supplier=Digi-Key
R4 R5 = RES 4K7 1206: as R1 on sheet STM32; Supplier: Digi-Key; Supplier Part Number: 311-4.70KFRCT-ND; Manufacturer Part Number: RC1206FR-074K7L; RoHS: Yes; Category: Chip SMD Resistors; Stock: 2180352; Pricing: 1=0,1, 10=0,036, 50=0,0232, 100=0,0195, 500=0,01364, 1000=0,01187 (USD); Case/Package: 1206; Pins: 2; Case Code (Imperial): 1206; Case Code (Metric): 3216; Min Operating Temperature: -55°C; Max Operating Temperature: 155°C; Tolerance: 1%; Packaging: Tape and Reel; Resistor Type: Thick Film; Voltage Rating: 200V; Series: RC02H; Resistance Tolerance: 1%; Width: 1.6mm; Lead Free: Lead Free; Reach SVHC Compliant: Unknown; RoHS Compliant: Yes
R6 = RES 0K 0603: Zero Ohm Resistor, Jumper, 0603 [1608 Metric], Thick Film, 100 mW, 1 A, Surface Mount; Manufacturer: Yageo; Tolerance: 1%; Power Rating: 100mW; Voltage Rating (DC): 50V; Temperature Coefficient: 200ppm/°C; Resistance Tolerance: 5%; Designed By: Ahmet Can; Supplier: Digi-Key; Supplier Part Number: 311-0.0GRCT-ND; Manufacturer Part Number: RC0603JR-070RL; RoHS: Yes; Category: Chip SMD Resistors; Stock: 5815021; Pricing: 1=0,1, 10=0,016, 25=0,0112, 50=0,0086, 100=0,0063, 250=0,0048, 500=0,00386, 1000=0,00284 (USD); Case/Package: 0603; Pins: 2; Contact Plating: Tin,Matte; Case Code (Imperial): 0603; Case Code (Metric): 1608; Min Operating Temperature: -55°C; Max Operating Temperature: 155°C; Resistor Type: Thick Film; Packaging: Tape and Reel; Termination: SMD/SMT; Series: RC; Technology: THICK FILM; Package Quantity: 5000; Voltage Rating: 50V; Features: Moisture Resistant; Max Power Dissipation: 100mW; Number of Terminations: 2; Construction: Rectangular; Length: 1.6mm; Width: 0.8mm; Height: 0.45mm; Depth: 0.8mm; Lead Free: Lead Free; RoHS Compliant: Yes; Reach SVHC Compliant: Unknown; Military Standard: Not
R7 = RES 10K 1206: SMD Chip Resistor, 10 kOhm, ± 1%, 250 mW, 1206 [3216 Metric], Thick Film, General Purpose; Manufacturer: Yageo; Temperature Coefficient: 100ppm/°C; Power Rating: 250mW; Voltage Rating: 200V; Designed By: Ahmet Can; Supplier: Digi-Key; Supplier Part Number: 311-10.0KFRCT-ND; Manufacturer Part Number: RC1206FR-0710KL; RoHS: Yes; Category: Chip SMD Resistors; Stock: 3977916; Pricing: 1=0,1, 10=0,036, 50=0,0232, 100=0,0195, 500=0,01364, 1000=0,01187 (USD); Case/Package: 1206; Case Code (Imperial): 1206; Case Code (Metric): 3216; Min Operating Temperature: -55°C; Max Operating Temperature: 155°C; Tolerance: 1%; Packaging: Tape and Reel; Resistor Type: Thick Film; Package Quantity: 5000; Termination: SMD/SMT; Features: Moisture Resistant; Series: RC; Max Power Dissipation: 250mW; Number of Terminations: 2; Resistance Tolerance: 1%; Voltage Rating (AC): 200V; Length: 3.1mm; Width: 1.6mm; Height: 0.55mm; Lead Free: Lead Free; Reach SVHC Compliant: Unknown; RoHS Compliant: Yes; ComponentLink1URL: https://datasheet.ciiva.com/46445/444357-46445703.pdf?src-supplier=Element14; ComponentLink1Description: https://datasheet.ciiva.com/46445/444357-46445703.pdf?src-supplier=Element14; ComponentLink2URL: https://datasheet.ciiva.com/7857/1692832-7857244.pdf?src-supplier=Element14; ComponentLink2Description: https://datasheet.ciiva.com/7857/1692832-7857244.pdf?src-supplier=Element14; ComponentLink3URL: https://datasheet.ciiva.com/7857/1692832-7857245.pdf?src-supplier=Element14; ComponentLink3Description: https://datasheet.ciiva.com/7857/1692832-7857245.pdf?src-supplier=Element14
U1 = U_MPU6050: IMU ACCEL/GYRO 3-AXIS I2C 24QFN; Manufacturer: TDK InvenSense; Sensor Type: Accelerometer, Gyroscope, 6 Axis; Output Type: I²C; Designed By: Ahmet Can; Supplier: Digi-Key; Supplier Part Number: 1428-1007-1-ND; Manufacturer Part Number: MPU-6050; RoHS: Yes; Category: Inertial Measurement Units (IMUs); Stock: 40546; Pricing: 1=8,71, 10=6,969, 25=6,4464, 100=5,5752, 500=5,22676, 1000=4,8783 (USD); ComponentLink1URL: https://datasheet.ciiva.com/1513/1788002-1513632.pdf?src-supplier=Element14; ComponentLink1Description: https://datasheet.ciiva.com/1513/1788002-1513632.pdf?src-supplier=Element14; ComponentLink2URL: https://datasheet.ciiva.com/22731/1788002-22731434.pdf?src-supplier=Element14; ComponentLink2Description: https://datasheet.ciiva.com/22731/1788002-22731434.pdf?src-supplier=Element14; Min Operating Temperature: -40°C; Max Operating Temperature: 85°C
U2 = U_STM32F103C8T6: ARM Cortex-M3 STM32 F1 Microcontroller 32-Bit 72MHz 64kB FLASH LQFP48 STM32F103C8T6; Manufacturer: STMicroelectronics; RAM Size: 20KB; Interface: I2C,SPI,USB,CAN,USART; Number of I/Os: 37; Number of Timers/Counters: 3; Max Supply Voltage: 3.6V; Number of ADC Channels: 10; Min Supply Voltage: 2V; Data Bus Width: 32b; Nominal Supply Current: 1.7uA; Number of A/D Converters: 2NUMBER; Number of Channels: 10NUMBER; Designed By: Ahmet Can; Supplier: Digi-Key; Supplier Part Number: 497-6063-ND; Manufacturer Part Number: STM32F103C8T6; RoHS: Yes; Category: Microcontrollers; Stock: 3317; Pricing: 1=6,42, 25=5,5256, 100=4,7979, 500=4,17798, 2500=3,5672 (USD); Case/Package: LQFP; Pins: 48; Weight: 0.006349oz; Min Operating Temperature: -40°C; Max Operating Temperature: 85°C; Packaging: Tray; Package Quantity: 1500; Memory Format: FLASH; Clock Frequency: 72MHz; Memory Size: 64KB; Core Architecture: ARM; Series: STM32F103C8; Length: 7mm; Width: 7mm; Height: 1.4mm; Lead Free: Lead Free; RoHS Compliant: Yes; ComponentLink1URL: https://datasheet.ciiva.com/8054/1730126-8054942.pdf?src-supplier=Element14; ComponentLink1Description: https://datasheet.ciiva.com/8054/1730126-8054942.pdf?src-supplier=Element14; ComponentLink2URL: https://datasheet.ciiva.com/48687/001075658-da-01-en-mcu-64kb-mem-stm32f103c8t6-lqfp-48-stm-48687589.pdf?src-supplier=Conrad; ComponentLink2Description: https://datasheet.ciiva.com/48687/001075658-da-01-en-mcu-64kb-mem-stm32f103c8t6-lqfp-48-stm-48687589.pdf?src-supplier=Conrad
U3 = U_MS560702BA03-50: Board Mount Pressure Sensor 0.01bar to 1.2bar Absolute 8-Pin QFN T/R; Manufacturer: TE Connectivity; Operating Pressure: 0.15PSI ~ 17.4PSI (1kPa ~ 120kPa); Output Type: I²C, SPI; Supply Voltage: 1.8V ~ 3.6V; Designed By: Ahmet Can; Supplier: Digi-Key; Supplier Part Number: 223-1198-1-ND; Manufacturer Part Number: MS560702BA03-50; RoHS: Yes; Category: Pressure Sensors; Stock: 66297; Pricing: 1=10,86, 10=8,686, 25=8,0344, 100=6,9488, 500=6,5145, 1000=6,0802 (USD); ComponentLink1URL: http://www.farnell.com/datasheets/1756127.pdf?src-supplier=Farnell; ComponentLink1Description: http://www.farnell.com/datasheets/1756127.pdf?src-supplier=Farnell; ComponentLink2URL: https://datasheet.octopart.com/MS560702BA03-50-TE-Connectivity-datasheet-21074431.pdf?src-supplier=Element14; ComponentLink2Description: https://datasheet.octopart.com/MS560702BA03-50-TE-Connectivity-datasheet-21074431.pdf?src-supplier=Element14; ComponentLink3URL: https://www.te.com/commerce/DocumentDelivery/DDEController?Action=srchrtrv&DocNm=MS5607-02BA03&DocType=Data+Sheet&DocLang=English&src-supplier=Digi-Key; ComponentLink3Description: https://www.te.com/commerce/DocumentDelivery/DDEController?Action=srchrtrv&DocNm=MS5607-02BA03&DocType=Data+Sheet&DocLang=English&src-supplier=Digi-Key; ComponentLink4URL: https://datasheet.octopart.com/MS560702BA03-50-TE-Connectivity-datasheet-15137560.pdf?src-supplier=Future+Electronics; ComponentLink4Description: https://datasheet.octopart.com/MS560702BA03-50-TE-Connectivity-datasheet-15137560.pdf?src-supplier=Future+Electronics; ComponentLink5URL: https://datasheet.octopart.com/MS560702BA03-50-TE-Connectivity-datasheet-65793091.pdf?src-supplier=Sager+Electronics; ComponentLink5Description: https://datasheet.octopart.com/MS560702BA03-50-TE-Connectivity-datasheet-65793091.pdf?src-supplier=Sager+Electronics; ComponentLink6URL: https://datasheet.octopart.com/MS560702BA03-50-TE-Connectivity-datasheet-93687046.pdf?src-supplier=Master+Electronics; ComponentLink6Description: https://datasheet.octopart.com/MS560702BA03-50-TE-Connectivity-datasheet-93687046.pdf?src-supplier=Master+Electronics
XTAL1 = XTAL_CRYSTAL_8 MHz: 8 MHz ±10ppm Crystal 10pF 100 Ohms 4-SMD, No Lead; Manufacturer: ECS International; Supplier: Digi-Key; Supplier Part Number: 50-ECS-80-10-30B-CKM-CT-ND; Manufacturer Part Number: ECS-80-10-30B-CKM-TR; RoHS: No; Stock: 25024; Pricing: 1=0,66, 10=0,581, 50=0,5432, 100=0,48, 500=0,45474 (USD)

## Nets that join several sheets
3V3DC: STM32 (7 pins), MCUs_STM32 (19 pins)
GND: STM32 (23 pins), MCUs_STM32 (28 pins)
NetJ1_2: STM32 (J1.2), MCUs_STM32 (U2.12)
NetJ1_3: STM32 (J1.3), MCUs_STM32 (U2.13)
NetJ2_2: STM32 (J2.2), MCUs_STM32 (U2.34)
NetJ2_3: STM32 (J2.3), MCUs_STM32 (U2.37)
NetJ2_4: STM32 (J2.4), MCUs_STM32 (U2.38)
NetJ3_2: STM32 (J3.2), MCUs_STM32 (U2.30)
NetJ3_3: STM32 (J3.3), MCUs_STM32 (U2.31)
NetJ6_2: STM32 (J6.2), MCUs_STM32 (U2.25)
NetJ6_3: STM32 (J6.3), MCUs_STM32 (U2.28)
NetJ6_5: STM32 (J6.5), MCUs_STM32 (U2.26)
NetJ6_7: STM32 (J6.7), MCUs_STM32 (U2.27)
NetR2_1: STM32 (R2.1), MCUs_STM32 (U2.19)